# EAGLE schematic irisc (EAGLE 9.2.2)

## Sheet 1 of 6
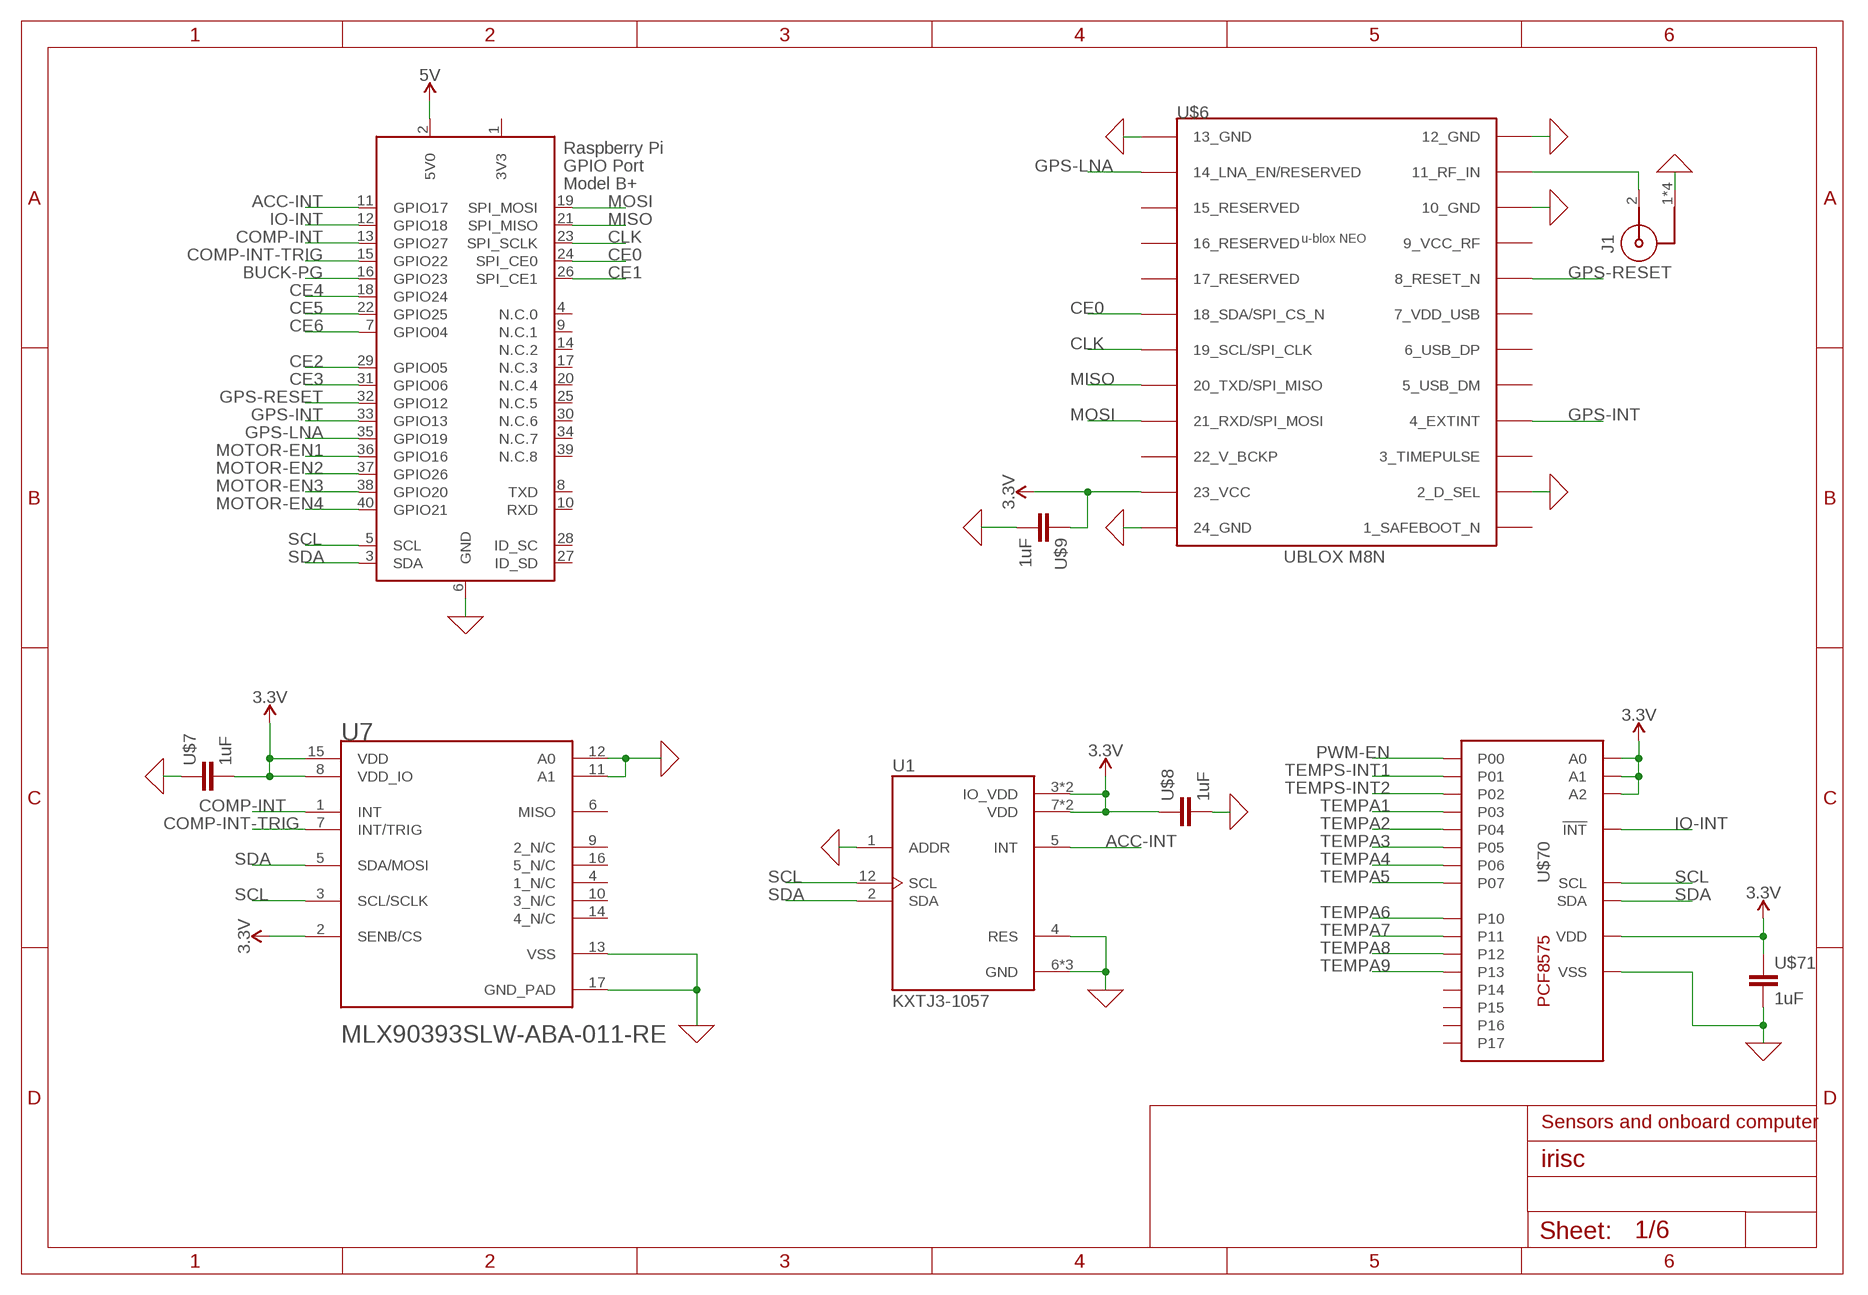
[diagram p0: schematic, sheet 1]

### Parts
J1  60314202124525  [60314202124525]
U1  KXTJ3-1057  [KIONIX_KXTJ3-1057]
U7  MELEXIS_TECHNOLOGIES_MLX90393SLW-ABA-011-REMELEXIS_TECHNOLOGIES_MLX90393SLW-ABA-011-RE_0_0  [MELEXIS_TECHNOLOGIES_MLX90393SLW-ABA-011-RE_0]
U$6  NEO-M8  [NEO-M8]
U$7  1uF  CAPACITOR_0603_N  [RESC0603_N]
U$8  1uF  CAPACITOR_0603_N  [RESC0603_N]
U$9  1uF  CAPACITOR_0603_N  [RESC0603_N]
U$70  PCF8575C  [SOP24]
U$71  1uF  CAPACITOR_0603_N  [RESC0603_N]
X1  RASPI_BOARD_B+_E4  [RASPI_BOARD_B+_EDGES_4DRILL]

### Nets
0: J1.1 J1.3 J1.4 J1.5 U1.1(ADDR) U1.4(RES) U1.6(GND) U1.8(GND) U1.9(GND) U7.11(A1) U7.12(A0) U7.13(VSS) U7.17(GND_PAD) U$6.2(2_D_SEL) U$6.10(10_GND) U$6.12(12_GND) U$6.13(13_GND) U$6.24(24_GND) U$7.1 U$8.2 U$9.2 U$70.P$12(VSS) U$71.2 X1.6(GND) ; supply symbol labelled GND ; also sheet 2,3,4,5,6
3.3V: U1.3(IO_VDD) U1.7(VDD) U1.10(VDD) U1.11(IO_VDD) U7.2(SENB/CS) U7.8(VDD_IO) U7.15(VDD) U$6.23(23_VCC) U$7.2 U$8.1 U$9.1 U$70.P$2(A1) U$70.P$3(A2) U$70.P$21(A0) U$70.P$24(VDD) U$71.1 ; also sheet 6
5V: X1.2(5V0) ; also sheet 2,3,4,5,6
ACC-INT: U1.5(INT) X1.11(GPIO17)
BUCK-PG: X1.16(GPIO23)
CE0: U$6.18(18_SDA/SPI_CS_N) X1.24(SPI_CE0)
CE1: X1.26(SPI_CE1) ; also sheet 3
CE2: X1.29(GPIO05) ; also sheet 3
CE3: X1.31(GPIO06) ; also sheet 3
CE4: X1.18(GPIO24)
CE5: X1.22(GPIO25)
CE6: X1.7(GPIO04)
CLK: U$6.19(19_SCL/SPI_CLK) X1.23(SPI_SCLK) ; also sheet 2,3
COMP-INT: U7.1(INT) X1.13(GPIO27)
COMP-INT-TRIG: U7.7(INT/TRIG) X1.15(GPIO22)
GPS-INT: U$6.4(4_EXTINT) X1.33(GPIO13)
GPS-LNA: U$6.14(14_LNA_EN/RESERVED) X1.35(GPIO19)
GPS-RESET: U$6.8(8_RESET_N) X1.32(GPIO12)
IO-INT: U$70.P$1(!INT) X1.12(GPIO18)
MISO: U$6.20(20_TXD/SPI_MISO) X1.21(SPI_MISO) ; also sheet 2,3
MOSI: U$6.21(21_RXD/SPI_MOSI) X1.19(SPI_MOSI) ; also sheet 2
MOTOR-EN1: X1.36(GPIO16) ; also sheet 3
MOTOR-EN2: X1.37(GPIO26) ; also sheet 3
MOTOR-EN3: X1.38(GPIO20) ; also sheet 3
MOTOR-EN4: X1.40(GPIO21) ; also sheet 3
N$39: J1.2 U$6.11(11_RF_IN)
PWM-EN: U$70.P$4(P00) ; also sheet 3
SCL: U1.12(SCL) U7.3(SCL/SCLK) U$70.P$22(SCL) X1.5(SCL) ; also sheet 3,4
SDA: U1.2(SDA) U7.5(SDA/MOSI) U$70.P$23(SDA) X1.3(SDA) ; also sheet 3,4
TEMPA1: U$70.P$7(P03) ; also sheet 5
TEMPA2: U$70.P$8(P04) ; also sheet 5
TEMPA3: U$70.P$9(P05) ; also sheet 5
TEMPA4: U$70.P$10(P06) ; also sheet 5
TEMPA5: U$70.P$11(P07) ; also sheet 5
TEMPA6: U$70.P$13(P10) ; also sheet 5
TEMPA7: U$70.P$14(P11) ; also sheet 5
TEMPA8: U$70.P$15(P12) ; also sheet 5
TEMPA9: U$70.P$16(P13) ; also sheet 5
TEMPS-INT1: U$70.P$5(P01)
TEMPS-INT2: U$70.P$6(P02)
Unconnected: U7.4(1_N/C) U7.6(MISO) U7.9(2_N/C) U7.10(3_N/C) U7.14(4_N/C) U7.16(5_N/C) U$6.1(1_SAFEBOOT_N) U$6.3(3_TIMEPULSE) U$6.5(5_USB_DM) U$6.6(6_USB_DP) U$6.7(7_VDD_USB) U$6.9(9_VCC_RF) U$6.15(15_RESERVED) U$6.16(16_RESERVED) U$6.17(17_RESERVED) U$6.22(22_V_BCKP) U$70.P$17(P14) U$70.P$18(P15) U$70.P$19(P16) U$70.P$20(P17) X1.4(N.C.0) X1.8(TXD) X1.9(N.C.1) X1.10(RXD) X1.14(N.C.2) X1.17(N.C.3) X1.20(N.C.4) X1.25(N.C.5) X1.27(ID_SD) X1.28(ID_SC) X1.30(N.C.6) X1.34(N.C.7) X1.39(N.C.8)

### Notes on the sheet
- Sensors and onboard computer

## Sheet 2 of 6
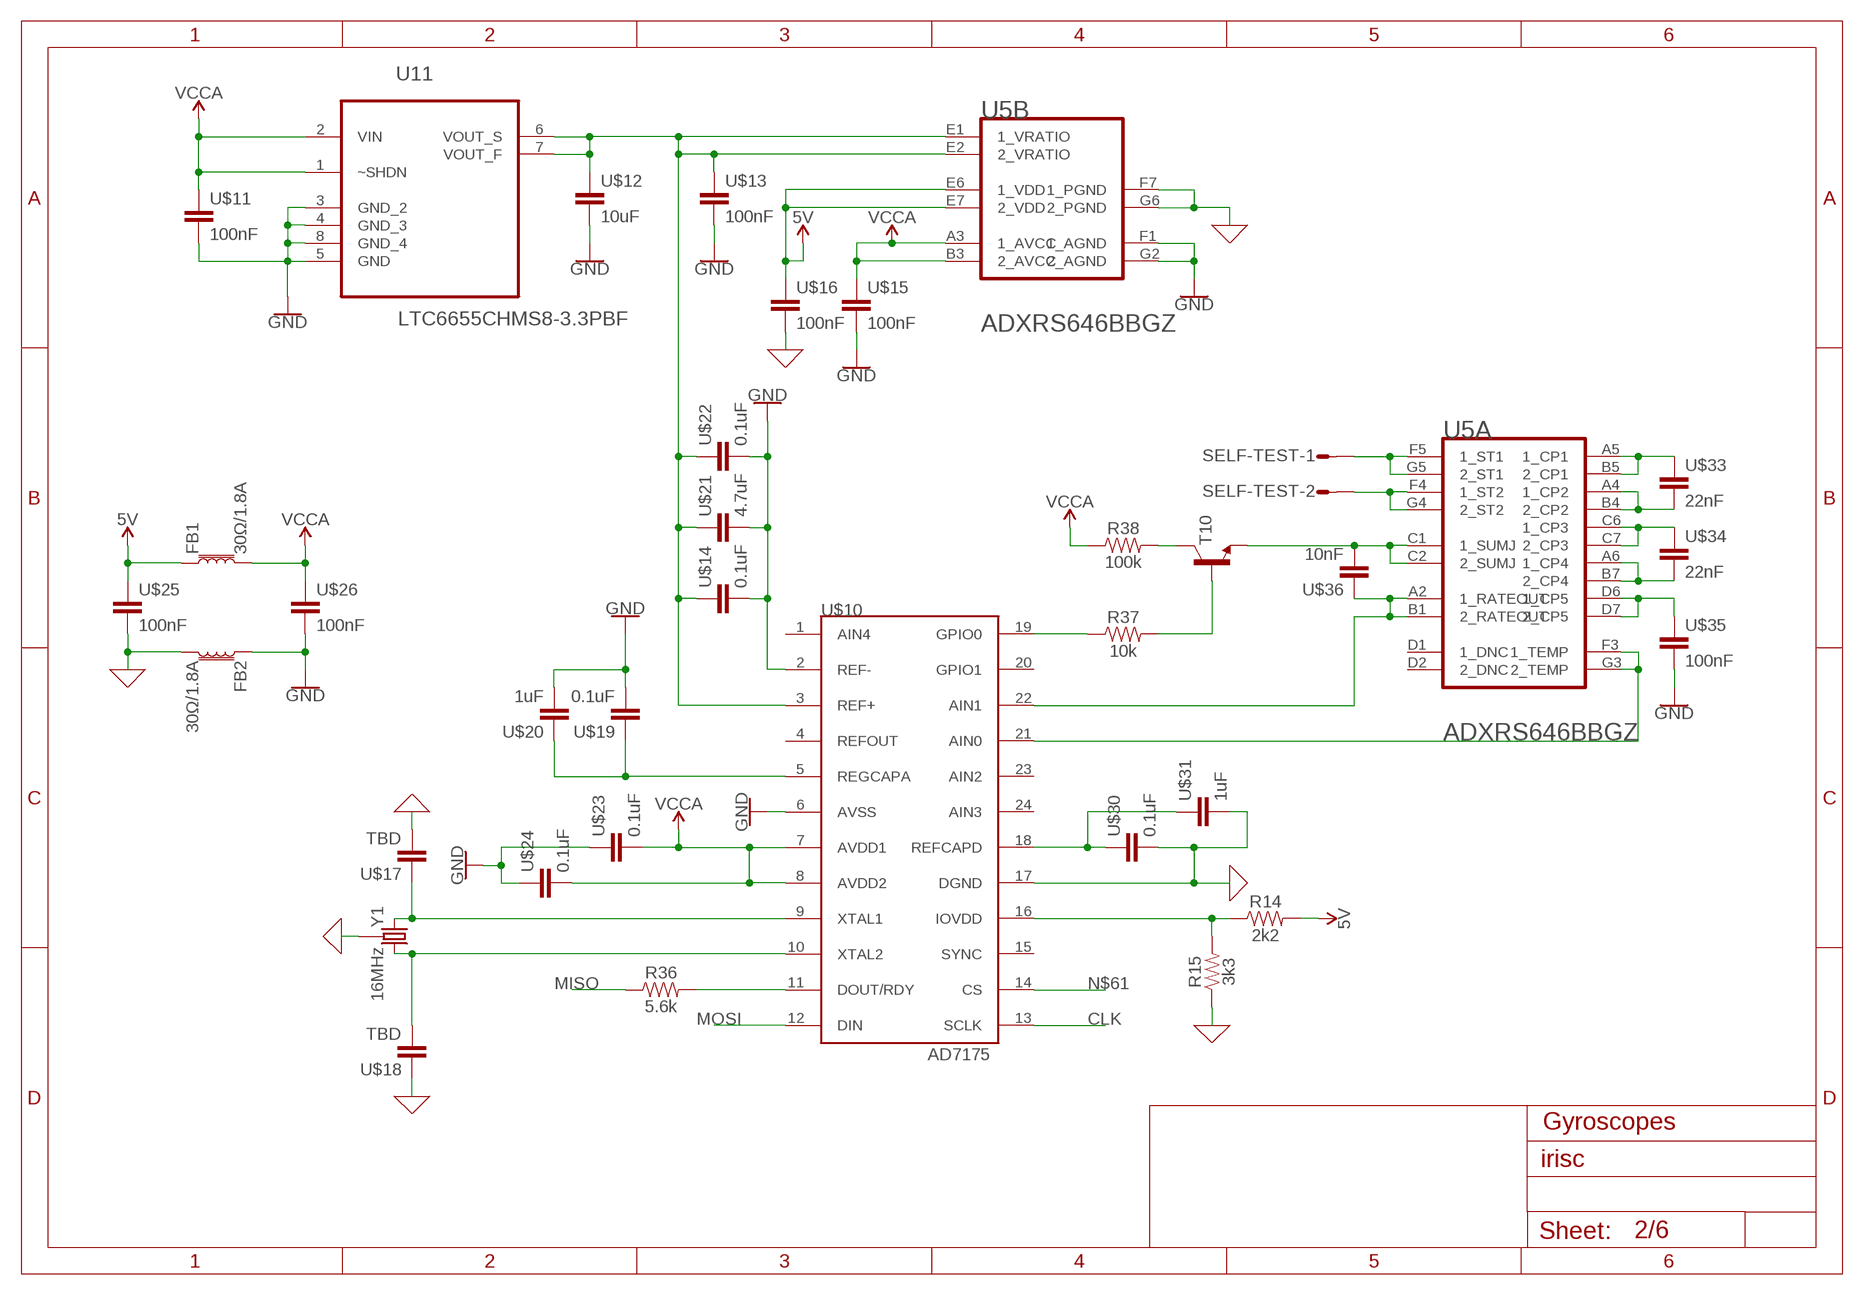
[diagram p1: schematic, sheet 2]

### Parts
FB1  30Ω/1.8A  FERRITE_BEAD-0603  [0603]
FB2  30Ω/1.8A  FERRITE_BEAD-0603  [0603]
R14  2k2  0.11OHM-2010-1/2W-1%  [2010]
R15  3k3  0.11OHM-2010-1/2W-1%  [2010]
R36  5.6k  5.6KOHM-0603-1/10W-1%  [0603]
R37  10k  100KOHM-0603-1/10W-1%  [0603]
R38  100k  100KOHM-0603-1/10W-1%  [0603]
SELF-TEST  L02P  [L02P]
T10  -NPN-SOT23-BEC  [SOT23-BEC]
U5  ANALOG_DEVICES_ADXRS646BBGZANALOG_DEVICES_ADXRS646BBGZ_0_0  [ANALOG_DEVICES_ADXRS646BBGZ_0]
U11  LTC6655CHMS8-3.3PBF  [SOP65P490X110-8N]
U$10  AD7175  [TSSOP24]
U$11  100nF  CAPACITOR_0603_N  [RESC0603_N]
U$12  10uF  CAPACITOR_0603_N  [RESC0603_N]
U$13  100nF  CAPACITOR_0603_N  [RESC0603_N]
U$14  0.1uF  CAPACITOR_0603_N  [RESC0603_N]
U$15  100nF  CAPACITOR_0603_N  [RESC0603_N]
U$16  100nF  CAPACITOR_0603_N  [RESC0603_N]
U$17  TBD  CAPACITOR_0603_N  [RESC0603_N]
U$18  TBD  CAPACITOR_0603_N  [RESC0603_N]
U$19  0.1uF  CAPACITOR_0603_N  [RESC0603_N]
U$20  1uF  CAPACITOR_0603_N  [RESC0603_N]
U$21  4.7uF  CAPACITOR_0603_N  [RESC0603_N]
U$22  0.1uF  CAPACITOR_0603_N  [RESC0603_N]
U$23  0.1uF  CAPACITOR_0603_N  [RESC0603_N]
U$24  0.1uF  CAPACITOR_0603_N  [RESC0603_N]
U$25  100nF  CAPACITOR_0603_N  [RESC0603_N]
U$26  100nF  CAPACITOR_0603_N  [RESC0603_N]
U$30  0.1uF  CAPACITOR_0603_N  [RESC0603_N]
U$31  1uF  CAPACITOR_0603_N  [RESC0603_N]
U$33  22nF  CAPACITOR_0603_N  [RESC0603_N]
U$34  22nF  CAPACITOR_0603_N  [RESC0603_N]
U$35  100nF  CAPACITOR_0603_N  [RESC0603_N]
U$36  10nF  CAPACITOR_0603_N  [RESC0603_N]
Y1  16MHz  CRYSTAL-26MHZSMD-3.2X2.5  [CRYSTAL-SMD-3.2X2.5MM]

### Nets
0: FB2.2 R15.1 U5.F7(B:1_PGND) U5.G6(B:2_PGND) U$10.17(DGND) U$16.2 U$17.2 U$18.1 U$25.2 U$30.2 U$31.2 Y1.2 Y1.4 ; supply symbol labelled GND ; also sheet 1,3,4,5,6
5V: FB1.1 R14.2 U5.E6(B:1_VDD) U5.E7(B:2_VDD) U$16.1 U$25.1 ; also sheet 1,3,4,5,6
CLK: U$10.13(SCLK) ; also sheet 1,3
GND: FB2.1 U5.F1(B:1_AGND) U5.G2(B:2_AGND) U11.3(GND_2) U11.4(GND_3) U11.5(GND) U11.8(GND_4) U$10.2(REF-) U$10.6(AVSS) U$11.2 U$12.2 U$13.2 U$14.2 U$15.2 U$19.2 U$20.2 U$21.2 U$22.2 U$23.1 U$24.1 U$26.2 U$35.2 ; also sheet 6
MISO: R36.1 ; also sheet 1,3
MOSI: U$10.12(DIN) ; also sheet 1
N$40: U$10.9(XTAL1) U$17.1 Y1.1
N$42: SELF-TEST.1 U5.F5(A:1_ST1) U5.G5(A:2_ST1)
N$43: R38.2 T10.C
N$44: U$10.10(XTAL2) U$18.2 Y1.3
N$45: U$10.5(REGCAPA) U$19.1 U$20.1
N$46: R37.2 T10.B
N$47: SELF-TEST.2 U5.F4(A:1_ST2) U5.G4(A:2_ST2)
N$48: U5.E1(B:1_VRATIO) U5.E2(B:2_VRATIO) U11.6(VOUT_S) U11.7(VOUT_F) U$10.3(REF+) U$12.1 U$13.1 U$14.1 U$21.1 U$22.1
N$50: R14.1 R15.2 U$10.16(IOVDD)
N$51: U$10.18(REFCAPD) U$30.1 U$31.1
N$52: U5.D6(A:1_CP5) U5.D7(A:2_CP5) U$35.1
N$53: T10.E U5.C1(A:1_SUMJ) U5.C2(A:2_SUMJ) U$36.2
N$54: U5.A6(A:1_CP4) U5.B7(A:2_CP4) U$34.2
N$55: U5.C6(A:1_CP3) U5.C7(A:2_CP3) U$34.1
N$56: U5.A4(A:1_CP2) U5.B4(A:2_CP2) U$33.2
N$57: U5.A5(A:1_CP1) U5.B5(A:2_CP1) U$33.1
N$58: U5.A2(A:1_RATEOUT) U5.B1(A:2_RATEOUT) U$10.22(AIN1) U$36.1
N$59: U5.F3(A:1_TEMP) U5.G3(A:2_TEMP) U$10.21(AIN0)
N$61: U$10.14(CS)
N$66: R37.1 U$10.19(GPIO0)
SDF: R36.2 U$10.11(DOUT/RDY)
VCCA: FB1.2 R38.1 U5.A3(B:1_AVCC) U5.B3(B:2_AVCC) U11.1(~SHDN) U11.2(VIN) U$10.7(AVDD1) U$10.8(AVDD2) U$11.1 U$15.1 U$23.2 U$24.2 U$26.1
Unconnected: U5.D1(A:1_DNC) U5.D2(A:2_DNC) U$10.1(AIN4) U$10.4(REFOUT) U$10.15(SYNC) U$10.20(GPIO1) U$10.23(AIN2) U$10.24(AIN3)

### Notes on the sheet
- Gyroscopes

## Sheet 3 of 6
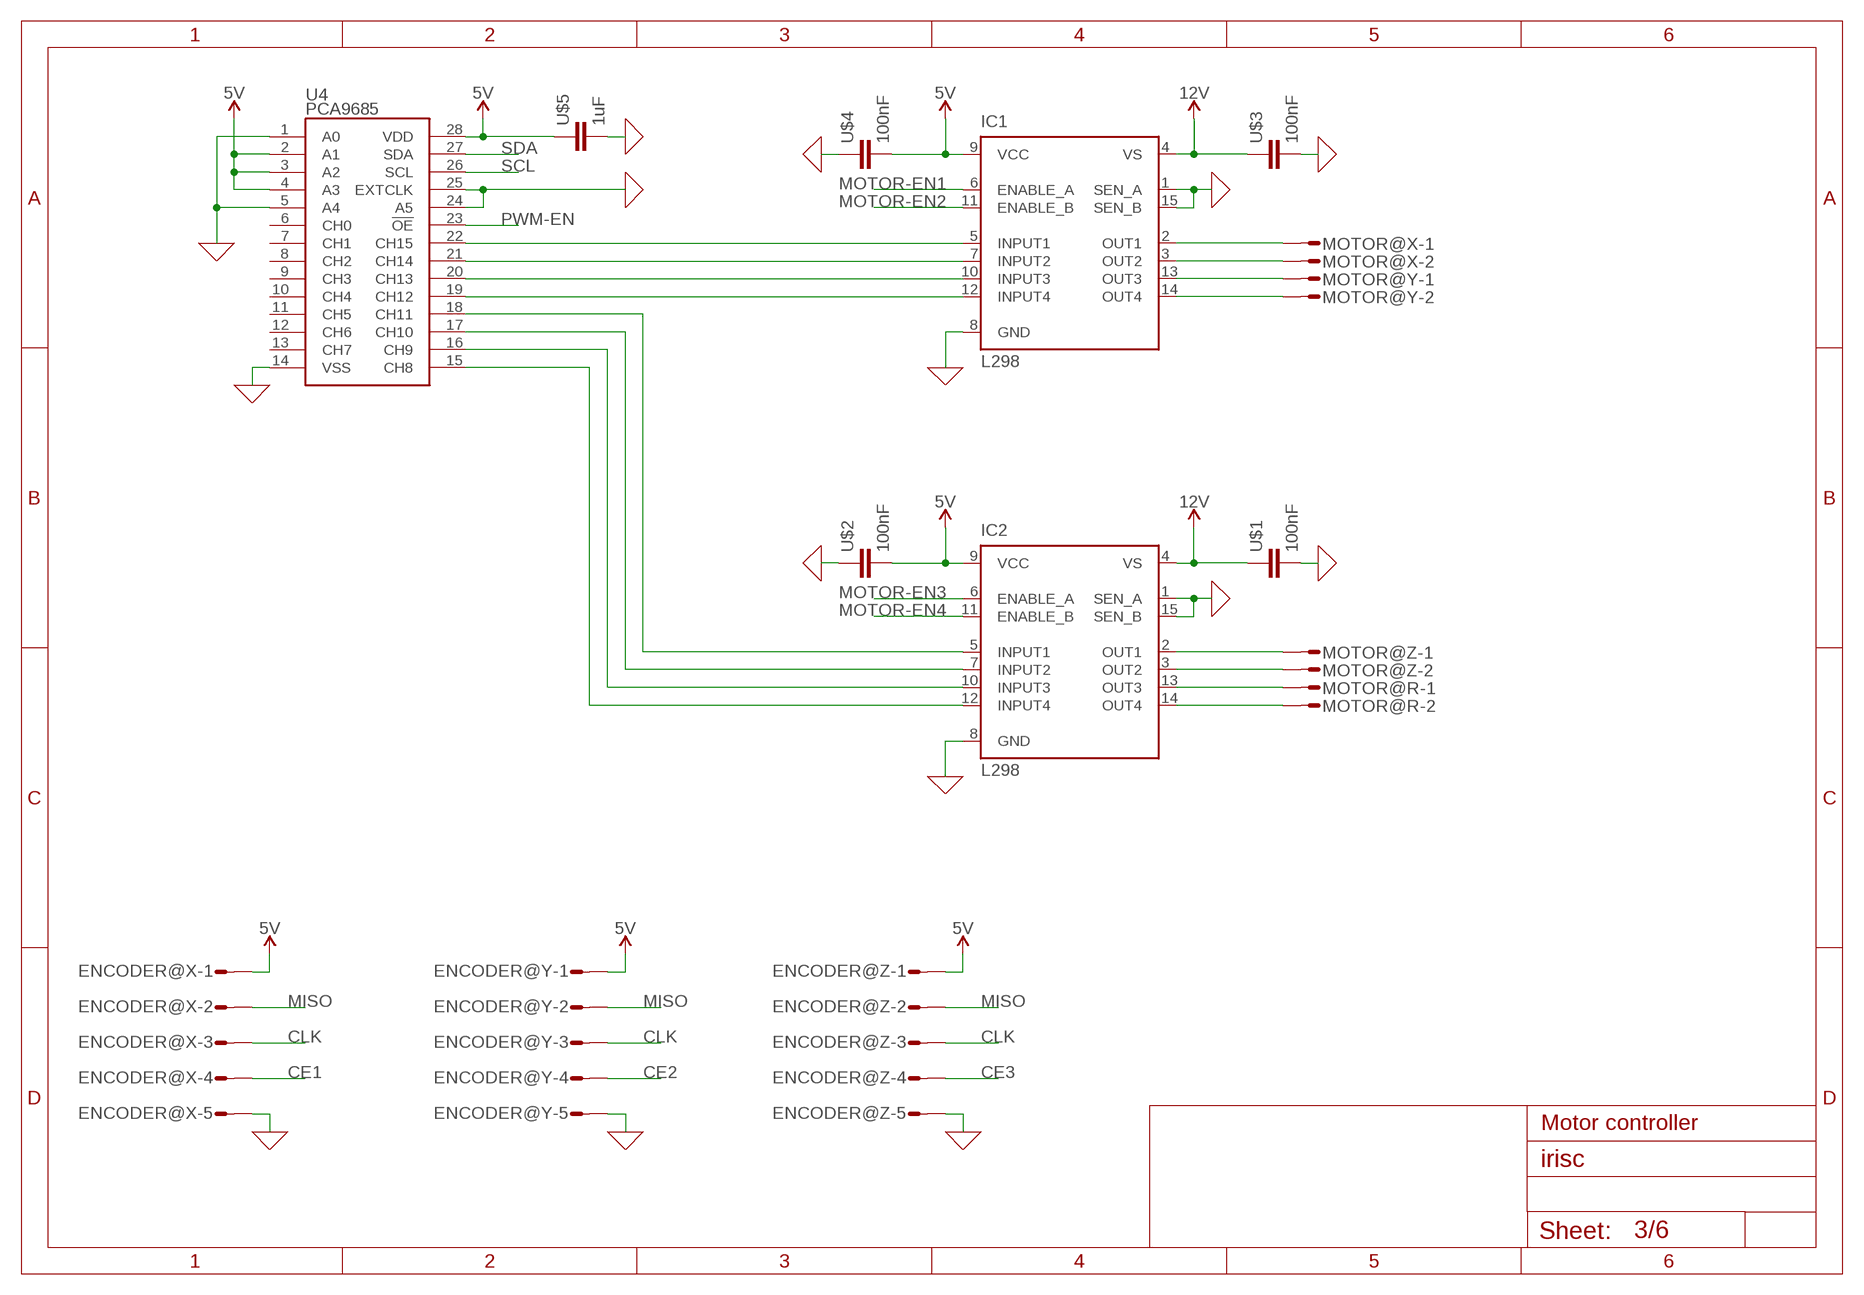
[diagram p2: schematic, sheet 3]

### Parts
ENCODER@X  L05P  [L05P]
ENCODER@Y  L05P  [L05P]
ENCODER@Z  L05P  [L05P]
IC1  L298  [MULTIWATT-15]
IC2  L298  [MULTIWATT-15]
MOTOR@R  L02P  [L02P]
MOTOR@X  L02P  [L02P]
MOTOR@Y  L02P  [L02P]
MOTOR@Z  L02P  [L02P]
U4  PCA9685  [TSSOP-28_4MM]
U$1  100nF  CAPACITOR_0805_L  [RESC0805_L]
U$2  100nF  CAPACITOR_0805_L  [RESC0805_L]
U$3  100nF  CAPACITOR_0805_L  [RESC0805_L]
U$4  100nF  CAPACITOR_0805_L  [RESC0805_L]
U$5  1uF  CAPACITOR_0805_L  [RESC0805_L]

### Nets
0: ENCODER@X.5 ENCODER@Y.5 ENCODER@Z.5 IC1.1(SEN_A) IC1.8(GND) IC1.15(SEN_B) IC2.1(SEN_A) IC2.8(GND) IC2.15(SEN_B) U4.1(A0) U4.5(A4) U4.14(VSS) U4.24(A5) U4.25(EXTCLK) U$1.2 U$2.1 U$3.2 U$4.1 U$5.2 ; supply symbol labelled GND ; also sheet 1,2,4,5,6
5V: ENCODER@X.1 ENCODER@Y.1 ENCODER@Z.1 IC1.9(VCC) IC2.9(VCC) U4.2(A1) U4.3(A2) U4.4(A3) U4.28(VDD) U$2.2 U$4.2 U$5.1 ; also sheet 1,2,4,5,6
12V: IC1.4(VS) IC2.4(VS) U$1.1 U$3.1 ; also sheet 6
CE1: ENCODER@X.4 ; also sheet 1
CE2: ENCODER@Y.4 ; also sheet 1
CE3: ENCODER@Z.4 ; also sheet 1
CLK: ENCODER@X.3 ENCODER@Y.3 ENCODER@Z.3 ; also sheet 1,2
MISO: ENCODER@X.2 ENCODER@Y.2 ENCODER@Z.2 ; also sheet 1,2
MOTOR-EN1: IC1.6(ENABLE_A) ; also sheet 1
MOTOR-EN2: IC1.11(ENABLE_B) ; also sheet 1
MOTOR-EN3: IC2.6(ENABLE_A) ; also sheet 1
MOTOR-EN4: IC2.11(ENABLE_B) ; also sheet 1
N$1: IC1.5(INPUT1) U4.22(CH15)
N$5: IC1.7(INPUT2) U4.21(CH14)
N$10: IC1.10(INPUT3) U4.20(CH13)
N$19: IC1.12(INPUT4) U4.19(CH12)
N$22: IC2.5(INPUT1) U4.18(CH11)
N$27: IC2.7(INPUT2) U4.17(CH10)
N$28: IC2.10(INPUT3) U4.16(CH9)
N$30: IC2.12(INPUT4) U4.15(CH8)
N$31: IC1.2(OUT1) MOTOR@X.1
N$32: IC1.3(OUT2) MOTOR@X.2
N$33: IC1.13(OUT3) MOTOR@Y.1
N$34: IC1.14(OUT4) MOTOR@Y.2
N$35: IC2.2(OUT1) MOTOR@Z.1
N$36: IC2.3(OUT2) MOTOR@Z.2
N$37: IC2.13(OUT3) MOTOR@R.1
N$38: IC2.14(OUT4) MOTOR@R.2
PWM-EN: U4.23(!OE) ; also sheet 1
SCL: U4.26(SCL) ; also sheet 1,4
SDA: U4.27(SDA) ; also sheet 1,4
Unconnected: U4.6(CH0) U4.7(CH1) U4.8(CH2) U4.9(CH3) U4.10(CH4) U4.11(CH5) U4.12(CH6) U4.13(CH7)

### Notes on the sheet
- Motor controller

## Sheet 4 of 6
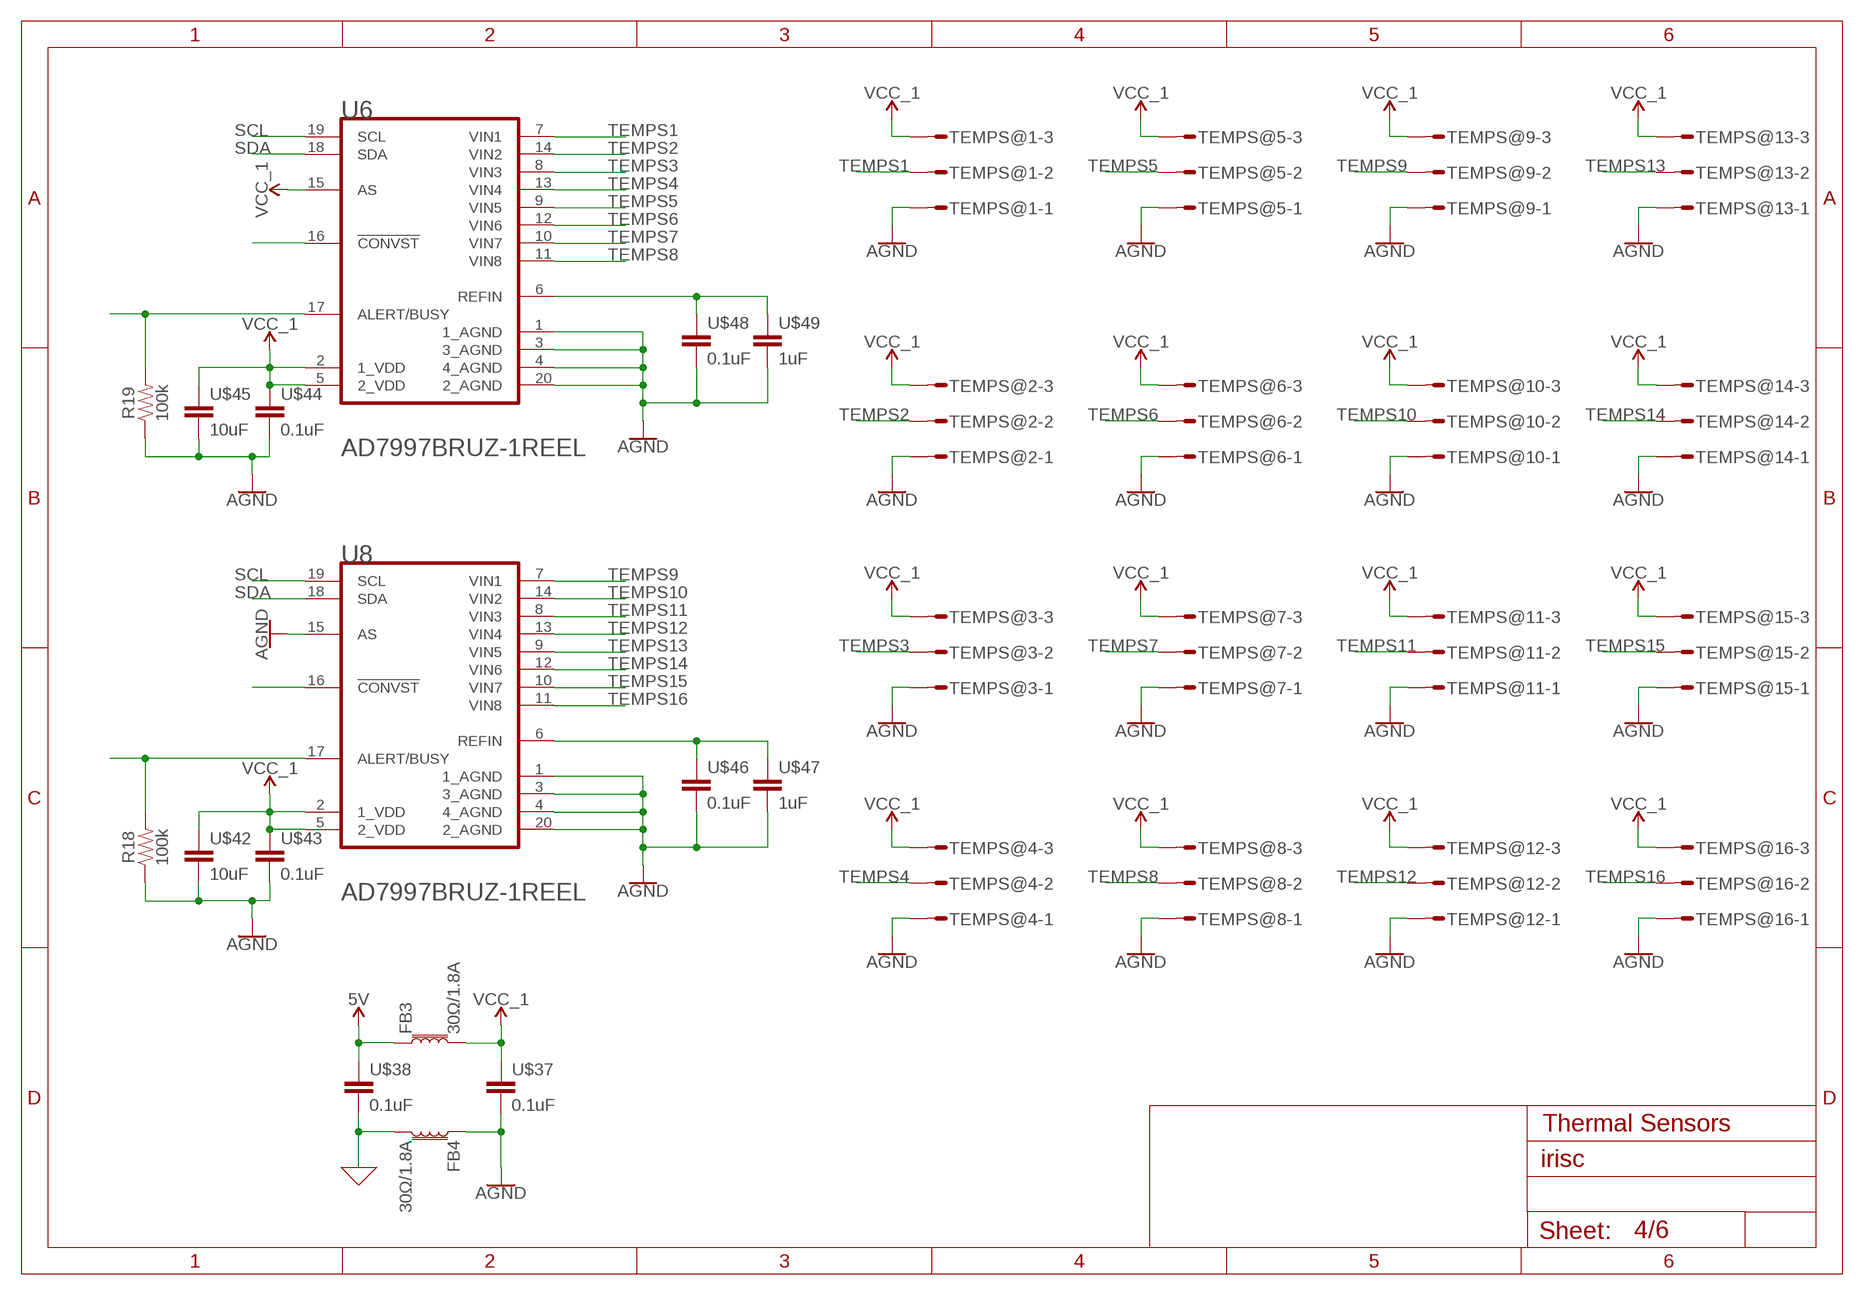
[diagram p3: schematic, sheet 4]

### Parts
FB3  30Ω/1.8A  FERRITE_BEAD-0603  [0603]
FB4  30Ω/1.8A  FERRITE_BEAD-0603  [0603]
R18  100k  100KOHM-0603-1/10W-1%  [0603]
R19  100k  100KOHM-0603-1/10W-1%  [0603]
TEMPS@1  L03P  [L03P]
TEMPS@2  L03P  [L03P]
TEMPS@3  L03P  [L03P]
TEMPS@4  L03P  [L03P]
TEMPS@5  L03P  [L03P]
TEMPS@6  L03P  [L03P]
TEMPS@7  L03P  [L03P]
TEMPS@8  L03P  [L03P]
TEMPS@9  L03P  [L03P]
TEMPS@10  L03P  [L03P]
TEMPS@11  L03P  [L03P]
TEMPS@12  L03P  [L03P]
TEMPS@13  L03P  [L03P]
TEMPS@14  L03P  [L03P]
TEMPS@15  L03P  [L03P]
TEMPS@16  L03P  [L03P]
U6  ANALOG_DEVICES_AD7997BRUZ-1REELANALOG_DEVICES_AD7997BRUZ-1REEL_0_0  [ANALOG_DEVICES_AD7997BRUZ-1REEL_0]
U8  ANALOG_DEVICES_AD7997BRUZ-1REELANALOG_DEVICES_AD7997BRUZ-1REEL_0_0  [ANALOG_DEVICES_AD7997BRUZ-1REEL_0]
U$37  0.1uF  CAPACITOR_0603_N  [RESC0603_N]
U$38  0.1uF  CAPACITOR_0603_N  [RESC0603_N]
U$42  10uF  CAPACITOR_0603_N  [RESC0603_N]
U$43  0.1uF  CAPACITOR_0603_N  [RESC0603_N]
U$44  0.1uF  CAPACITOR_0603_N  [RESC0603_N]
U$45  10uF  CAPACITOR_0603_N  [RESC0603_N]
U$46  0.1uF  CAPACITOR_0603_N  [RESC0603_N]
U$47  1uF  CAPACITOR_0603_N  [RESC0603_N]
U$48  0.1uF  CAPACITOR_0603_N  [RESC0603_N]
U$49  1uF  CAPACITOR_0603_N  [RESC0603_N]

### Nets
0: FB4.2 U$38.2 ; supply symbol labelled GND ; also sheet 1,2,3,5,6
5V: FB3.1 U$38.1 ; also sheet 1,2,3,5,6
AGND: FB4.1 R18.1 R19.1 TEMPS@1.1 TEMPS@2.1 TEMPS@3.1 TEMPS@4.1 TEMPS@5.1 TEMPS@6.1 TEMPS@7.1 TEMPS@8.1 TEMPS@9.1 TEMPS@10.1 TEMPS@11.1 TEMPS@12.1 TEMPS@13.1 TEMPS@14.1 TEMPS@15.1 TEMPS@16.1 U6.1(1_AGND) U6.3(3_AGND) U6.4(4_AGND) U6.20(2_AGND) U8.1(1_AGND) U8.3(3_AGND) U8.4(4_AGND) U8.15(AS) U8.20(2_AGND) U$37.2 U$42.2 U$43.2 U$44.2 U$45.2 U$46.2 U$47.2 U$48.2 U$49.2
N$60: U8.6(REFIN) U$46.1 U$47.1
N$62: R18.2 U8.17(ALERT/BUSY)
N$63: U6.6(REFIN) U$48.1 U$49.1
N$64: U8.16(!CONVST!)
N$67: R19.2 U6.17(ALERT/BUSY)
N$68: U6.16(!CONVST!)
SCL: U6.19(SCL) U8.19(SCL) ; also sheet 1,3
SDA: U6.18(SDA) U8.18(SDA) ; also sheet 1,3
TEMPS1: TEMPS@1.2 U6.7(VIN1)
TEMPS2: TEMPS@2.2 U6.14(VIN2)
TEMPS3: TEMPS@3.2 U6.8(VIN3)
TEMPS4: TEMPS@4.2 U6.13(VIN4)
TEMPS5: TEMPS@5.2 U6.9(VIN5)
TEMPS6: TEMPS@6.2 U6.12(VIN6)
TEMPS7: TEMPS@7.2 U6.10(VIN7)
TEMPS8: TEMPS@8.2 U6.11(VIN8)
TEMPS9: TEMPS@9.2 U8.7(VIN1)
TEMPS10: TEMPS@10.2 U8.14(VIN2)
TEMPS11: TEMPS@11.2 U8.8(VIN3)
TEMPS12: TEMPS@12.2 U8.13(VIN4)
TEMPS13: TEMPS@13.2 U8.9(VIN5)
TEMPS14: TEMPS@14.2 U8.12(VIN6)
TEMPS15: TEMPS@15.2 U8.10(VIN7)
TEMPS16: TEMPS@16.2 U8.11(VIN8)
VCC_1: FB3.2 TEMPS@1.3 TEMPS@2.3 TEMPS@3.3 TEMPS@4.3 TEMPS@5.3 TEMPS@6.3 TEMPS@7.3 TEMPS@8.3 TEMPS@9.3 TEMPS@10.3 TEMPS@11.3 TEMPS@12.3 TEMPS@13.3 TEMPS@14.3 TEMPS@15.3 TEMPS@16.3 U6.2(1_VDD) U6.5(2_VDD) U6.15(AS) U8.2(1_VDD) U8.5(2_VDD) U$37.1 U$42.1 U$43.1 U$44.1 U$45.1

### Notes on the sheet
- Thermal Sensors

## Sheet 5 of 6
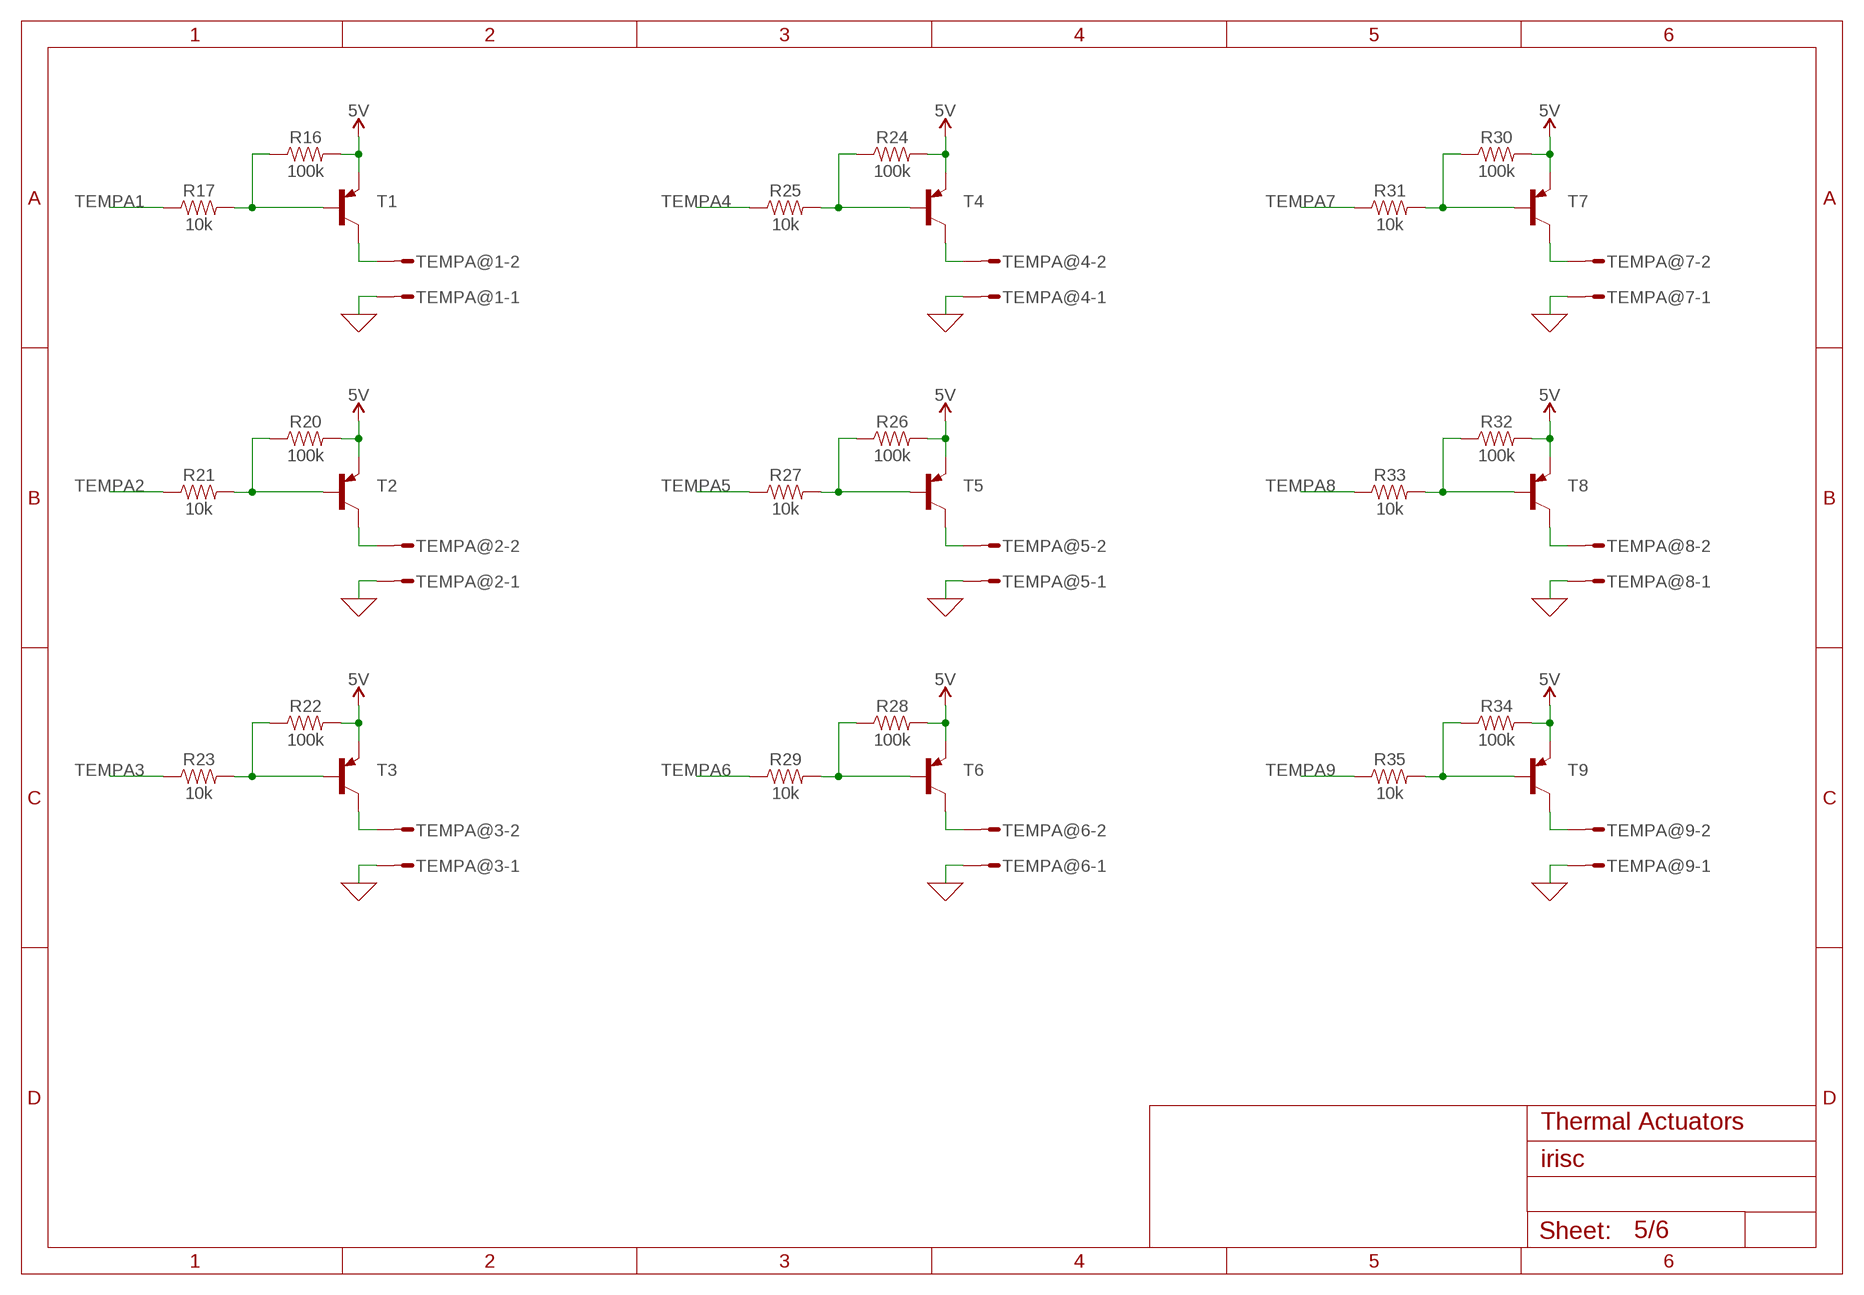
[diagram p4: schematic, sheet 5]

### Parts
R16  100k  100KOHM-0603-1/10W-1%  [0603]
R17  10k  100KOHM-0603-1/10W-1%  [0603]
R20  100k  100KOHM-0603-1/10W-1%  [0603]
R21  10k  100KOHM-0603-1/10W-1%  [0603]
R22  100k  100KOHM-0603-1/10W-1%  [0603]
R23  10k  100KOHM-0603-1/10W-1%  [0603]
R24  100k  100KOHM-0603-1/10W-1%  [0603]
R25  10k  100KOHM-0603-1/10W-1%  [0603]
R26  100k  100KOHM-0603-1/10W-1%  [0603]
R27  10k  100KOHM-0603-1/10W-1%  [0603]
R28  100k  100KOHM-0603-1/10W-1%  [0603]
R29  10k  100KOHM-0603-1/10W-1%  [0603]
R30  100k  100KOHM-0603-1/10W-1%  [0603]
R31  10k  100KOHM-0603-1/10W-1%  [0603]
R32  100k  100KOHM-0603-1/10W-1%  [0603]
R33  10k  100KOHM-0603-1/10W-1%  [0603]
R34  100k  100KOHM-0603-1/10W-1%  [0603]
R35  10k  100KOHM-0603-1/10W-1%  [0603]
T1  -PNP-SOT23-BEC  [SOT23-BEC]
T2  -PNP-SOT23-BEC  [SOT23-BEC]
T3  -PNP-SOT23-BEC  [SOT23-BEC]
T4  -PNP-SOT23-BEC  [SOT23-BEC]
T5  -PNP-SOT23-BEC  [SOT23-BEC]
T6  -PNP-SOT23-BEC  [SOT23-BEC]
T7  -PNP-SOT23-BEC  [SOT23-BEC]
T8  -PNP-SOT23-BEC  [SOT23-BEC]
T9  -PNP-SOT23-BEC  [SOT23-BEC]
TEMPA@1  L02P  [L02P]
TEMPA@2  L02P  [L02P]
TEMPA@3  L02P  [L02P]
TEMPA@4  L02P  [L02P]
TEMPA@5  L02P  [L02P]
TEMPA@6  L02P  [L02P]
TEMPA@7  L02P  [L02P]
TEMPA@8  L02P  [L02P]
TEMPA@9  L02P  [L02P]

### Nets
0: TEMPA@1.1 TEMPA@2.1 TEMPA@3.1 TEMPA@4.1 TEMPA@5.1 TEMPA@6.1 TEMPA@7.1 TEMPA@8.1 TEMPA@9.1 ; supply symbol labelled GND ; also sheet 1,2,3,4,6
5V: R16.2 R20.2 R22.2 R24.2 R26.2 R28.2 R30.2 R32.2 R34.2 T1.E T2.E T3.E T4.E T5.E T6.E T7.E T8.E T9.E ; also sheet 1,2,3,4,6
N$65: R16.1 R17.2 T1.B
N$69: T1.C TEMPA@1.2
N$70: R20.1 R21.2 T2.B
N$71: T2.C TEMPA@2.2
N$73: R22.1 R23.2 T3.B
N$74: T3.C TEMPA@3.2
N$76: R24.1 R25.2 T4.B
N$77: T4.C TEMPA@4.2
N$79: R26.1 R27.2 T5.B
N$80: T5.C TEMPA@5.2
N$82: R28.1 R29.2 T6.B
N$83: T6.C TEMPA@6.2
N$85: R30.1 R31.2 T7.B
N$86: T7.C TEMPA@7.2
N$88: R32.1 R33.2 T8.B
N$89: T8.C TEMPA@8.2
N$91: R34.1 R35.2 T9.B
N$92: T9.C TEMPA@9.2
TEMPA1: R17.1 ; also sheet 1
TEMPA2: R21.1 ; also sheet 1
TEMPA3: R23.1 ; also sheet 1
TEMPA4: R25.1 ; also sheet 1
TEMPA5: R27.1 ; also sheet 1
TEMPA6: R29.1 ; also sheet 1
TEMPA7: R31.1 ; also sheet 1
TEMPA8: R33.1 ; also sheet 1
TEMPA9: R35.1 ; also sheet 1

### Notes on the sheet
- Thermal Actuators

## Sheet 6 of 6
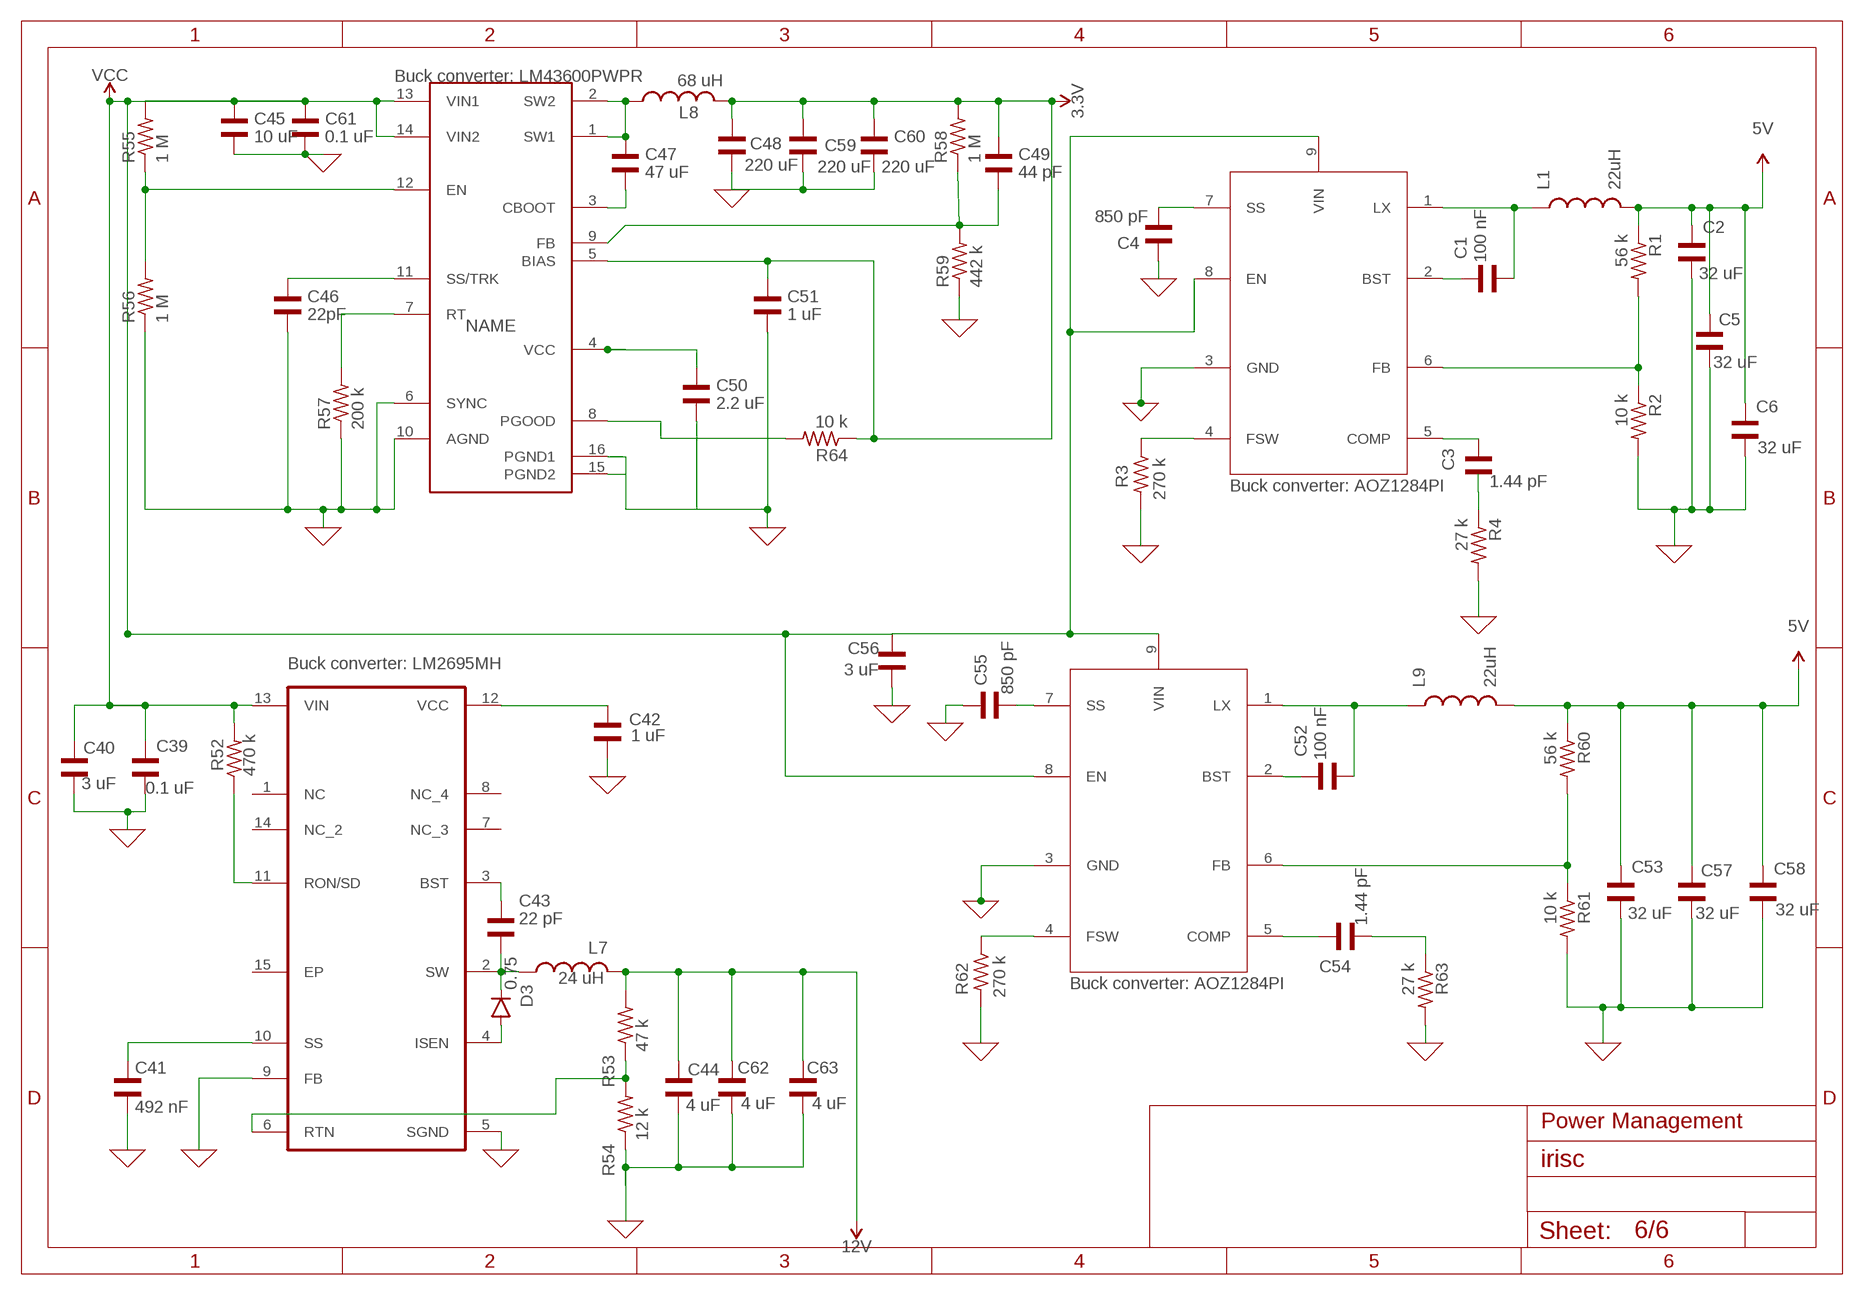
[diagram p5: schematic, sheet 6]

### Parts
BUCK_CONVERTER3  LM2695MH  [SOP65P640X110-15N]
BUCKCONVERTER1  BUCK-CONVERTER5V4A  [SO-8]
BUCKCONVERTER2  BUCK-CONVERTER5V4A  [SO-8]
C1  100 nF  WCAP-CSGP_0805_885012006018_WAVE  [WCAP-CSGP_0805_WAVE]
C2  32 uF  WCAP-CSGP_0805_885012006018_WAVE  [WCAP-CSGP_0805_WAVE]
C3  1.44 pF  WCAP-CSGP_0805_885012006018_WAVE  [WCAP-CSGP_0805_WAVE]
C4  850 pF  WCAP-CSGP_0805_885012006018_WAVE  [WCAP-CSGP_0805_WAVE]
C5  32 uF  WCAP-CSGP_0805_885012006018_WAVE  [WCAP-CSGP_0805_WAVE]
C6  32 uF  WCAP-CSGP_0805_885012006018_WAVE  [WCAP-CSGP_0805_WAVE]
C39  0.1 uF  WCAP-CSGP_0805_885012006082_REFLOW  [WCAP-CSGP_0805_REFLOW]
C40  3 uF  WCAP-CSGP_0805_885012006082_REFLOW  [WCAP-CSGP_0805_REFLOW]
C41  492 nF  WCAP-CSGP_0805_885012006018_WAVE  [WCAP-CSGP_0805_WAVE]
C42  1 uF  WCAP-CSGP_0805_885012006018_WAVE  [WCAP-CSGP_0805_WAVE]
C43  22 pF  WCAP-CSGP_0805_885012006018_WAVE  [WCAP-CSGP_0805_WAVE]
C44  4 uF  WCAP-CSGP_0805_885012006018_WAVE  [WCAP-CSGP_0805_WAVE]
C45  10 uF  WCAP-CSGP_0805_885012006018_WAVE  [WCAP-CSGP_0805_WAVE]
C46  22pF  WCAP-CSGP_0805_885012006018_WAVE  [WCAP-CSGP_0805_WAVE]
C47  47 uF  WCAP-CSGP_0805_885012006018_WAVE  [WCAP-CSGP_0805_WAVE]
C48  220 uF  WCAP-CSGP_0805_885012006018_WAVE  [WCAP-CSGP_0805_WAVE]
C49  44 pF  WCAP-CSGP_0805_885012006018_WAVE  [WCAP-CSGP_0805_WAVE]
C50  2.2 uF  WCAP-CSGP_0805_885012006018_WAVE  [WCAP-CSGP_0805_WAVE]
C51  1 uF  WCAP-CSGP_0805_885012006018_WAVE  [WCAP-CSGP_0805_WAVE]
C52  100 nF  WCAP-CSGP_0805_885012006018_WAVE  [WCAP-CSGP_0805_WAVE]
C53  32 uF  WCAP-CSGP_0805_885012006018_WAVE  [WCAP-CSGP_0805_WAVE]
C54  1.44 pF  WCAP-CSGP_0805_885012006018_WAVE  [WCAP-CSGP_0805_WAVE]
C55  850 pF  WCAP-CSGP_0805_885012006018_WAVE  [WCAP-CSGP_0805_WAVE]
C56  3 uF  WCAP-CSGP_0805_885012006018_WAVE  [WCAP-CSGP_0805_WAVE]
C57  32 uF  WCAP-CSGP_0805_885012006018_WAVE  [WCAP-CSGP_0805_WAVE]
C58  32 uF  WCAP-CSGP_0805_885012006018_WAVE  [WCAP-CSGP_0805_WAVE]
C59  220 uF  WCAP-CSGP_0805_885012006018_WAVE  [WCAP-CSGP_0805_WAVE]
C60  220 uF  WCAP-CSGP_0805_885012006018_WAVE  [WCAP-CSGP_0805_WAVE]
C61  0.1 uF  WCAP-CSGP_0805_885012006018_WAVE  [WCAP-CSGP_0805_WAVE]
C62  4 uF  WCAP-CSGP_0805_885012006018_WAVE  [WCAP-CSGP_0805_WAVE]
C63  4 uF  WCAP-CSGP_0805_885012006018_WAVE  [WCAP-CSGP_0805_WAVE]
D3  0.75  DIODE  [DIODE-1N4001-KIT]
L1  22uH  INDUCTOR  [L0603]
L7  24 uH  INDUCTOR  [L0603]
L8  68 uH  INDUCTOR  [L0603]
L9  22uH  INDUCTOR  [L0603]
R1  56 k  FLIPFLOP-RES  [0805-THM]
R2  10 k  FLIPFLOP-RES  [0805-THM]
R3  270 k  FLIPFLOP-RES  [0805-THM]
R4  27 k  FLIPFLOP-RES  [0805-THM]
R52  470 k  FLIPFLOP-RES  [0805-THM]
R53  47 k  FLIPFLOP-RES  [0805-THM]
R54  12 k  FLIPFLOP-RES  [0805-THM]
R55  1 M  FLIPFLOP-RES  [0805-THM]
R56  1 M  FLIPFLOP-RES  [0805-THM]
R57  200 k  FLIPFLOP-RES  [0805-THM]
R58  1 M  FLIPFLOP-RES  [0805-THM]
R59  442 k  FLIPFLOP-RES  [0805-THM]
R60  56 k  FLIPFLOP-RES  [0805-THM]
R61  10 k  FLIPFLOP-RES  [0805-THM]
R62  270 k  FLIPFLOP-RES  [0805-THM]
R63  27 k  FLIPFLOP-RES  [0805-THM]
R64  10 k  FLIPFLOP-RES  [0805-THM]
U20  BUCK_CONVERTER1  [SOP65P640X120-17N]

### Nets
0: BUCK_CONVERTER3.5(SGND) BUCK_CONVERTER3.9(FB) C2.1 C4.2 C5.1 C6.1 C39.1 C40.1 C41.1 C42.1 C44.1 C45.1 C48.1 C50.1 C51.1 C53.1 C55.2 C56.1 C57.1 C58.1 C59.1 C60.1 C61.1 C62.1 C63.1 R2.2 R3.2 R4.2 R54.1 R59.1 R61.2 R62.2 R63.2 U20.15(PGND2) U20.16(PGND1) ; supply symbol labelled GND ; also sheet 1,2,3,4,5
3.3V: C48.2 C49.2 C51.2 C59.2 C60.2 L8.2 R58.2 R64.1 U20.5(BIAS) ; also sheet 1
5V: C2.2 C5.2 C6.2 C53.2 C57.2 C58.2 L1.2 L9.2 R1.1 R60.1 ; also sheet 1,2,3,4,5
12V: C44.2 C62.2 C63.2 L7.2 R53.2 ; also sheet 3
GND: BUCKCONVERTER1.3(GND) BUCKCONVERTER2.3(GND) ; also sheet 2
N$2: BUCKCONVERTER2.1(LX) C1.1 L1.1
N$3: BUCKCONVERTER2.4(FSW) R3.1
N$4: BUCKCONVERTER2.5(COMP) C3.2
N$6: BUCKCONVERTER2.2(BST) C1.2
N$7: BUCKCONVERTER2.6(FB) R1.2 R2.1
N$8: C3.1 R4.1
N$123: BUCK_CONVERTER3.6(RTN) R53.1 R54.2
N$124: BUCK_CONVERTER3.12(VCC) C42.2
N$125: BUCK_CONVERTER3.3(BST) C43.2
N$126: BUCK_CONVERTER3.2(SW) C43.1 D3.C L7.1
N$127: BUCK_CONVERTER3.11(RON/SD) R52.1
N$128: BUCK_CONVERTER3.10(SS) C41.2
N$129: BUCK_CONVERTER3.4(ISEN) D3.A
N$130: R55.1 R56.2 U20.12(EN)
N$131: C46.2 U20.11(SS/TRK)
N$132: C47.2 L8.1 U20.1(SW1) U20.2(SW2)
N$133: C47.1 U20.3(CBOOT)
N$134: C49.1 R58.1 R59.2 U20.9(FB)
N$135: C50.2 U20.4(VCC)
N$136: BUCKCONVERTER1.1(LX) C52.1 L9.1
N$137: BUCKCONVERTER1.4(FSW) R62.1
N$138: BUCKCONVERTER1.5(COMP) C54.2
N$139: BUCKCONVERTER1.2(BST) C52.2
N$140: BUCKCONVERTER1.6(FB) R60.2 R61.1
N$141: C54.1 R63.1
N$142: R64.2 U20.8(PGOOD)
N$143: R57.2 U20.7(RT)
SS: BUCKCONVERTER1.7(SS) BUCKCONVERTER2.7(SS) C4.1 C55.1
SYNC: C46.1 R56.1 R57.1 U20.6(SYNC) U20.10(AGND) ; supply symbol labelled GND
VCC: BUCK_CONVERTER3.13(VIN) BUCKCONVERTER1.8(EN) BUCKCONVERTER1.9(VIN) BUCKCONVERTER2.8(EN) BUCKCONVERTER2.9(VIN) C39.2 C40.2 C45.2 C56.2 C61.2 R52.2 R55.2 U20.13(VIN1) U20.14(VIN2)
Unconnected: BUCK_CONVERTER3.1(NC) BUCK_CONVERTER3.7(NC_3) BUCK_CONVERTER3.8(NC_4) BUCK_CONVERTER3.14(NC_2) BUCK_CONVERTER3.15(EP)

### Notes on the sheet
- Buck converter: LM43600PWPR
- Buck converter: AOZ1284PI
- Buck converter: LM2695MH
- Buck converter: AOZ1284PI
- Power Management

## Power pins joined to a net without a drawn wire
3V3: X1.1(3V3)

## Library data of the parts
BUCK_CONVERTER3 = LM2695MH:LM2695MH: IC BUCK ADJ 1.25A; DESCRIPTION: High Voltage _30V, 1.25A_ Step Down Switching Regulator 14-HTSSOP -40 to 125; DIGI-KEY_PART_NUMBER: LM2695MH/NOPB-ND; DIGI-KEY_PURCHASE_URL: https://www.digikey.se/product-detail/en/texas-instruments/LM2695MH-NOPB/LM2695MH-NOPB-ND/973743?utm_source=snapeda&utm_medium=aggregator&utm_campaign=symbol; MF: Texas Instruments; MP: LM2695MH/NOPB; PACKAGE: HTSSOP-14 Texas Instruments
BUCKCONVERTER1 BUCKCONVERTER2 = SO-8:BUCK-CONVERTER5V4A: Buck converter used for IRISC Input voltage : 3-36V Output voltage : 5 V Output Current: 4A
C1-C6 C39-C63 = Wurth_Elektronik_Passive_Capacitors_rev18b:WCAP-CSGP_0805: WCAP-CSGP Ceramic Capacitors Characteristics Multilayer Ceramic Chip Capacitor Recommended soldering:Reflow, for 0603 and 0805 wave soldering is also allowed Operating temperature:-55 °C to +125 °C; Ceramic characteristics: Class I - NPO ; Class II -X7R, X5R High performance ceramic High capacitance stability Minimal aging Termination:Cu/Ni/Sn <http://katalog.we-online.de/media/images/eisos/WCAP-CSGP_pf2.jpg> Details see: http://katalog.we-online.de/en/pbs/WCAP-CSGP-0805? Created: 2015-01-28 2015 (C) Wurth Elektronik; SPICEPREFIX: C
D3 = BeagleBone_Blue_R3:DIODE: Diode These are standard reverse protection diodes and small signal diodes. SMA package can handle up to about 1A. SOD-323 can handle about 200mA. What the SOD-323 package when ordering, there are some mfgs out there that are 5-pin packages.; SPICEPREFIX: D
ENCODER@X ENCODER@Y ENCODER@Z = con-amp-mt:L05P: AMP MT CONNECTOR; OC_FARNELL: unknown; OC_NEWARK: unknown
FB1-FB4 = SparkFun-Coils:FERRITE_BEAD: Ferrite Bead (blocks, cores, rings, chokes, etc.) Inductor with layers of ferrite used to suppress high frequencies. Often used to isolate high frequency noise. SparkFun Products: IOIO-OTG - V2.2 <https://www.sparkfun.com/products/13613> SparkFun SAMD21 Mini Breakout <https://www.sparkfun.com/products/13664> SparkFun 6 Degrees of Freedom Breakout - LSM6DS3 <https://www.sparkfun.com/products/13339> SparkFun SAMD21 Dev Breakout <https://www.sparkfun.com/products/13672>; PROD_ID: NDUC-07859
IC1 IC2 = st-microelectronics:L298: DUAL FULL-BRIDGE DRIVER; MPN: L298N; OC_FARNELL: 1589425; OC_NEWARK: 32M1527
J1 = Wurth_Elektronik_Electromechanic_Coaxial _Connectors_rev18a:60314202124525: SMA PCB End Launch Plug Round Post for 1.6mm PCB WR-SMA ARTICLE PROPERTIES: PCB Thickness 1.6 mm MATERIAL PROPERTIES: Insulator Material PTFE Insulator Color White Center Contact Material Brass Center Contact Plating Gold, min. 0.76µm over Nickel Body Material Brass Body Plating Gold, min. 0.076µm over Nickel Coupling Nut Material Brass Coupling Nut Plating Gold, min. 0.076µm over Nickel KIND PROPERTIES: Interface MIL-STD-348 Connector Type SMA Gender Plug Orientation Type Straight GENERAL INFORMATION: Operating Temperature -65 °C up to +165 °C Compliance RoHS ELECTRICAL PROPERTIES: Impedance 50 Ω Frequency Range DC~18 GHz MECHANICAL PROPERTIES: Center Contact Retention (Axial) 26.7 N Mating Cycle 500 Cycles Coupling Nut Retention 267 N Recommended Mating Torque 57 Ncm PACKAGING PROPERTIES: Packaging Tray <http://katalog.we-online.de/media/images/v2/WR_SMA_60314202124525.jpg> Details see: http://katalog.we-online.de/em/datasheet/60314202124525.pdf Created 2018-04-24,Yingchun,Shan 2018(C) Würth Elektronik
L1 L7-L9 = BeagleBone_Blue_R3:INDUCTOR: Inductors Basic Inductor/Choke - 0603 and 1206. Footprints are not proven and vary greatly between part numbers. SRN6045- 33uH, 20% 1.4A
MOTOR@R MOTOR@X MOTOR@Y MOTOR@Z SELF-TEST TEMPA@1-TEMPA@9 = con-amp-mt:L02P: AMP MT CONNECTOR; OC_FARNELL: unknown; OC_NEWARK: unknown
R1-R4 R52-R64 = adafruit:FLIPFLOP-RES: Flip Flop resistor An 0805 resistor inside a standard 1/4W 5% resistor. Makes for easy mods; SPICEPREFIX: R
R14 R15 = SparkFun-Resistors:0.11OHM: 0.11Ω resistor A resistor is a passive two-terminal electrical component that implements electrical resistance as a circuit element. Resistors act to reduce current flow, and, at the same time, act to lower voltage levels within circuits. - Wikipedia; PROD_ID: RES-08354; VALUE: 0.11
R16 R18-R20 R22 R24 R26 R28 R30 R32 R34 R38 = SparkFun-Resistors:100KOHM: 100kΩ resistor A resistor is a passive two-terminal electrical component that implements electrical resistance as a circuit element. Resistors act to reduce current flow, and, at the same time, act to lower voltage levels within circuits. - Wikipedia; PROD_ID: RES-07828
R17 R21 R23 R25 R27 R29 R31 R33 R35 R37 = SparkFun-Resistors:100KOHM: 100kΩ resistor A resistor is a passive two-terminal electrical component that implements electrical resistance as a circuit element. Resistors act to reduce current flow, and, at the same time, act to lower voltage levels within circuits. - Wikipedia; PROD_ID: RES-07828; VALUE: 100k
R36 = SparkFun-Resistors:5.6KOHM: 5.6kΩ resistor A resistor is a passive two-terminal electrical component that implements electrical resistance as a circuit element. Resistors act to reduce current flow, and, at the same time, act to lower voltage levels within circuits. - Wikipedia; PROD_ID: RES-12378
T1-T9 = DC_LOAD_AU:*-PNP-: PNP Transistror
T10 = DC_LOAD_AU:*-NPN-: NPN Transistror BF959 corrected 2008.03.06
TEMPS@1-TEMPS@16 = con-amp-mt:L03P: AMP MT CONNECTOR; OC_FARNELL: unknown; OC_NEWARK: unknown
U1 = KXTJ3-1057:KXTJ3-1057: Mems Accelerometer, 2G/4G/8G, Lga-12; AVAILABILITY: Unavailable; DESCRIPTION: Mems Accelerometer, 2G/4G/8G, Lga-12; MF: Kionix Inc.; MP: KXTJ3-1057; PACKAGE: LGA-12 Kionix; PRICE: None
U4 = SparkFun-IC-Special-Function:PCA9685: 16-channel 12-bit PWM I2C interface Internal Oscillator 40Hz to 1kHz Can be totem pole or open collector 2.3V to 5.5V SparkFun Products SparkFun Block for Intel® Edison - PWM <https://www.sparkfun.com/products/13042> (DEV-13042) PROTO: IC-12240 PROD_ID: IC-12271; PROD_ID: IC-12271
U5 = Analog Devices - ADXRS646BBGZ:ANALOG_DEVICES_ADXRS646BBGZ: ADI-ADXRS646-BG-32-3; 3DB_BANDWIDTH: 1 KHz; CIIVA_IDS: 978111; COMPONENT_LINK_1_DESCRIPTION: Manufacturer URL; COMPONENT_LINK_1_URL: http://www.analog.com/en/index.html; COMPONENT_LINK_3_DESCRIPTION: Package Specification; COMPONENT_LINK_3_URL: http:/www.analog.com/static/imported-files/packages/6438543BG_32_3.pdf; COMPONENT_LINK_4_DESCRIPTION: Product URL; COMPONENT_LINK_4_URL: http://www.analog.com/en/mems-sensors/mems-gyroscopes/adxrs646/products/product.html; DATASHEET: http://www.analog.com/static/imported-files/data_sheets/ADXRS646.pdf; DATASHEET_VERSION: Rev. A; FOOTPRINT_VARIANT_NAME_0: Manufacturer Recommended; IMPORTED: yes; IMPORTED_FROM: vault; IMPORT_TS: 1521855654; MF: Analog Devices; MOUNTING_TECHNOLOGY: Surface Mount; MPN: ADXRS646BBGZ; NONLINIARITY: 0.01% of FS; OUTPUT_TYPE: Analog; PACKAGE: BG-32-3; PACKAGE_DESCRIPTION: 32-Ball Ceramic Ball Grid Array, 6.85 x 6.85 mm Body, 0.8 mm Pitch; PACKAGE_VERSION: 042307-A, 04/2007; PACKING: Tray; PREFIX: U; RELEASE_DATE: 1396258507; SENSITIVITY: 9 mV/degrees/s; SUPPLY_CURRENT: 4 mA; TEMP_SENSOR: Yes; VAULT_GUID: 39260BA0-1B05-41FE-9F0C-E391FDD8AF37; VAULT_REVISION: 44A55B5B-B9A1-45C2-8DBB-A65CD5D96A36; VOLTAGE_REFERENCE: No; VOLTAGE_SUPPLY_V: 5.75 to 6.25
U6 U8 = Analog Devices - AD7997BRUZ-1REEL:ANALOG_DEVICES_AD7997BRUZ-1REEL: ADI-AD7997-RU-20; CHANNELS: 8; CIIVA_IDS: 4380982; CODE__JEDEC: MO-153AC; COMPONENT_LINK_1_DESCRIPTION: Manufacturer URL; COMPONENT_LINK_1_URL: http://www.analog.com/en/index.html; COMPONENT_LINK_3_DESCRIPTION: Package Specification; COMPONENT_LINK_3_URL: http://www.analog.com/static/imported-files/packages/364515793657813558433715854054607941441RU20.pdf; COMPONENT_LINK_4_DESCRIPTION: Product URL; COMPONENT_LINK_4_URL: http://www.analog.com/en/analog-to-digital-converters/ad-converters/ad7997/products/product.html; DATASHEET: http://www.analog.com/static/imported-files/data_sheets/AD7997_7998.pdf; DATASHEET_VERSION: Rev.0; FOOTPRINT_VARIANT_NAME_0: Level C; FOOTPRINT_VARIANT_NAME_1: Level B; FOOTPRINT_VARIANT_NAME_2: Level A; IMPORTED: yes; IMPORTED_FROM: vault; IMPORT_TS: 1521848429; INTERFACE: I2C/Ser 2-Wire, Ser; MF: Analog Devices; MOUNTING_TECHNOLOGY: Surface Mount; MPN: AD7997BRUZ-1REEL; PACKAGE: RU-20; PACKAGE_DESCRIPTION: 20-Lead Thin Shrink Small Outline Package [TSSOP]; PACKAGE_VERSION: 2000; PACKING: Reel; PREFIX: U; RELEASE_DATE: 1387032128; RESOLUTION_BITS: 10; ROHS: Yes; THROUGHPUT_RATE_SPS: 79K; VAULT_GUID: A7ABE123-3A90-4C1F-BE7E-7FE114D63781; VAULT_REVISION: 98AE87BF-701A-419B-8AC8-345A379FE084
U7 = Melexis Technologies - MLX90393SLW-ABA-011-RE:MELEXIS_TECHNOLOGIES_MLX90393SLW-ABA-011-RE: Micropower Triaxis Magnetometer Datasheet; DATASHEET: https://www.melexis.com/-/media/files/documents/datasheets/mlx90393-datasheet-melexis.pdf; DIGIKEY_DESCRIPTION: IC Hall Effect Sensor X, Y, Z Axis 16-QFN (3x3); DIGIKEY_PART_NUMBER: MLX90393SLW-ABA-011-RECT-ND; IPC_LAND_PATTERN_NAME: QFN50P300X300X90-16; LEAD_FREE: yes; MF: Melexis Technologies; MOUSER_PART_NUMBER: 482-90393SLWABA011RE; MPN: MLX90393SLW-ABA-011-RE; PACKAGE: QFN-16; PREFIX: U; ROHS: yes; TEMPERATURE_RANGE_HIGH: +85°C; TEMPERATURE_RANGE_LOW: -20°C
U11 = LTC6655CHMS8-3.3PBF:LTC6655CHMS8-3.3PBF: 0.25ppm Noise, Low Drift Precision Buffered Reference; AVAILABILITY: Unavailable; DESCRIPTION: LTC6655 - 0.25ppm Noise, Low Drift Precision References; MF: Linear Technology/Analog; MP: LTC6655CHMS8-3.3#PBF; PACKAGE: MSOP-8 Linear Technology; PRICE: None
U20 = SOP65P640X120-17N:BUCK_CONVERTER1: Used for IRISC, buck converter. Input: Supply voltage: 3.5 - 36 V Output: Current: 0.5 A Operation temperature: -40 - 125 celcius
U$1-U$5 U$7-U$9 U$11-U$26 U$30 U$31 U$33-U$38 U$42-U$49 U$71 = Nordic_nRF:CAPACITOR: Generic chip capacitor
U$6 = ubloxLib:NEO-M8: u-blox NEO GNSS module
U$10 = Analog Devices - AD7997BRUZ-1REEL:AD7175
U$70 = pcf8575c:PCF8575C
X1 = raspberrypi_bastelstube_v13:RASPI_BOARD_B+: Raspberry Pi GPIO connector with markings for the outer dimensions of the Raspberry Pi board model B+ with different sets of drill holes or mounting pads
Y1 = SparkFun-Clocks:CRYSTAL-26MHZ: 26MHz Crystal w/ Ground Pin Digikey Example <http://www.digikey.com/product-detail/en/epson/TSX-3225%2026.0000MF09Z-AC3/SER3627CT-ND/1802878> Frequency: 26MHz Frequency Stability: ±9ppm Frequency Tolerance: ±10ppm Load Capacitance: 9pF SparkFun Products: SparkFun ESP32 Thing <https://www.sparkfun.com/products/13907> SparkFun ESP8266 Thing Dev Board <https://www.sparkfun.com/products/13711>; PROD_ID: XTAL-12454